# Altium schematic sheet Generator_REO.SchDoc
size 420 x 297 mm; SheetNumber: 2; SheetTotal: 6
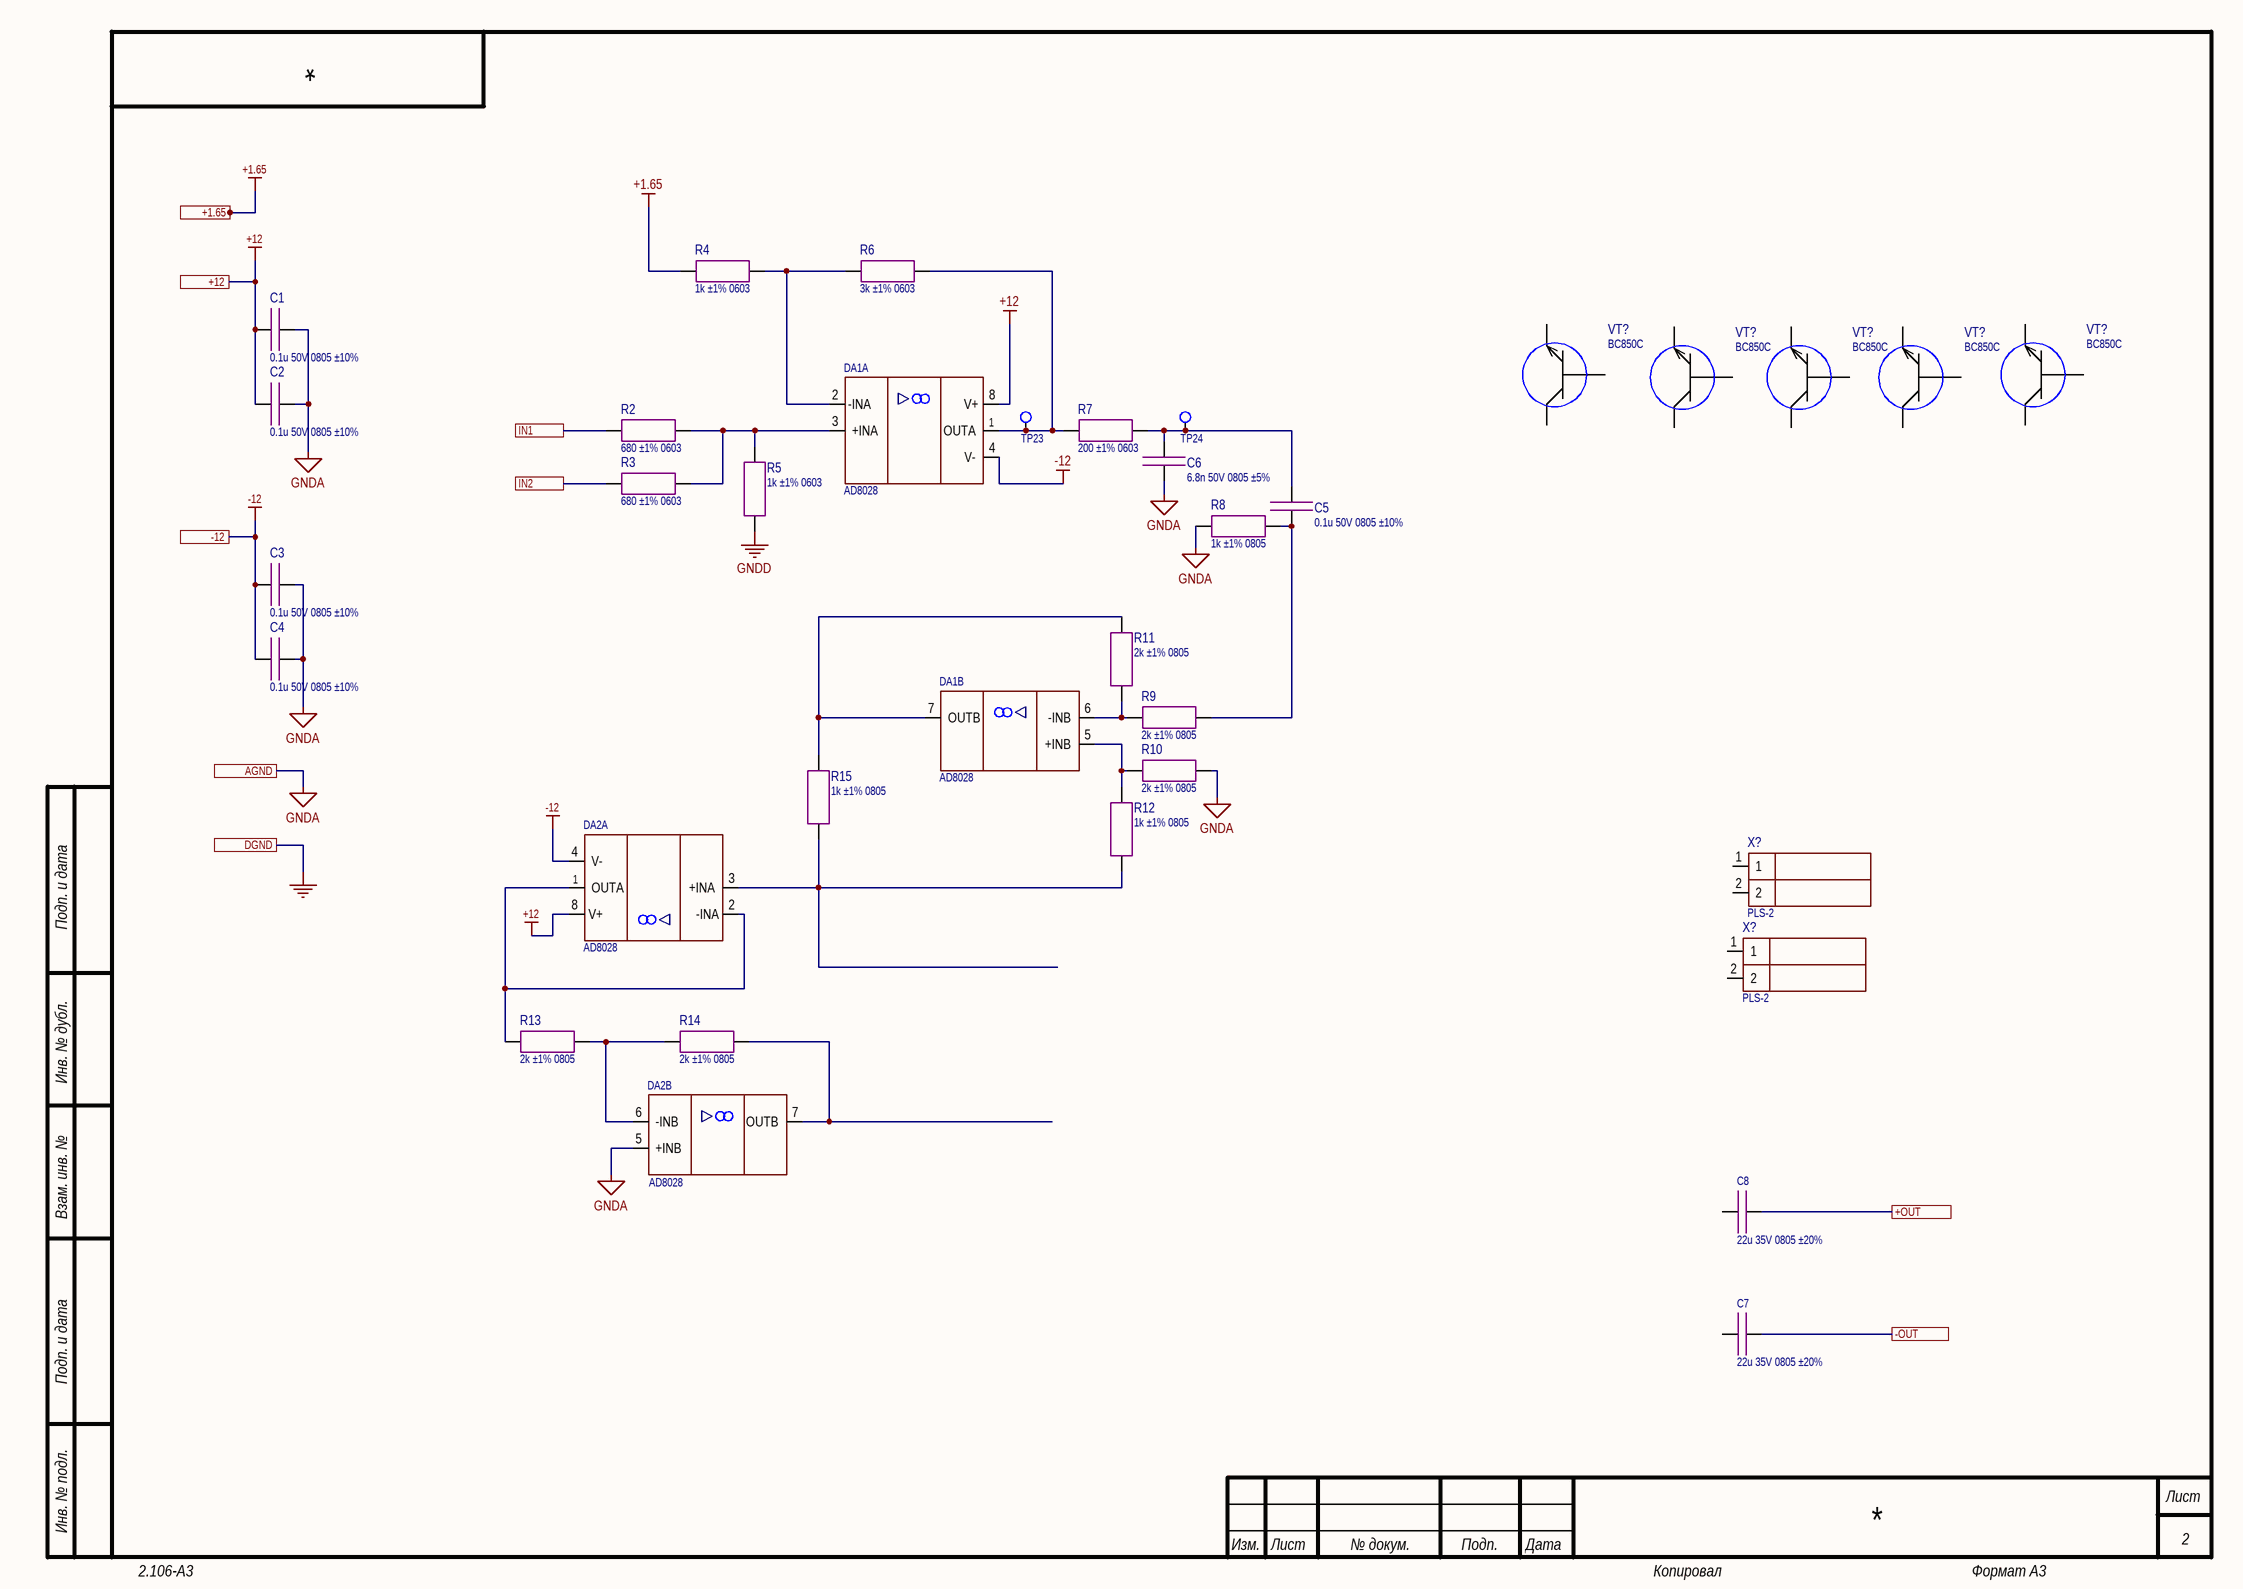
[diagram p0: Generator_REO.SchDoc]

## Parts
(Parts that share a designator on the sheet are numbered #1, #2 ... from top to bottom, then left to right.)
C1  0.1u 50V 0805 ±10%  [CAP: SMD 0805 MD IPC 782]
C2  0.1u 50V 0805 ±10%  [CAP: SMD 0805 MD IPC 782]
C3  0.1u 50V 0805 ±10%  [CAP: SMD 0805 MD IPC 782]
C4  0.1u 50V 0805 ±10%  [CAP: SMD 0805 MD IPC 782]
C5  0.1u 50V 0805 ±10%  [CAP: SMD 0805 MD IPC 782]
C6  6.8n 50V 0805 ±5%  [CAP: SMD 0805 MD IPC 782]
C7  22u 35V 0805 ±20%  [CAP: SMD 0805 MD IPC 782]
C8  22u 35V 0805 ±20%  [CAP: SMD 0805 MD IPC 782]
DA1  AD8028  [IC: SOIC 8]  (parts A,B of 2)
DA2  AD8028  [IC: SOIC 8]  (parts A,B of 2)
R2  680 ±1% 0603  [RES: SMD 0603 MD IPC 782]
R3  680 ±1% 0603  [RES: SMD 0603 MD IPC 782]
R4  1k ±1% 0603  [RES: SMD 0603 MD IPC 782]
R5  1k ±1% 0603  [RES: SMD 0603 MD IPC 782]
R6  3k ±1% 0603  [RES: SMD 0603 MD IPC 782]
R7  200 ±1% 0603  [RES: SMD 0603 MD IPC 782]
R8  1k ±1% 0805  [RES: SMD 0805 MD IPC 782]
R9  2k ±1% 0805  [RES: SMD 0805 MD IPC 782]
R10  2k ±1% 0805  [RES: SMD 0805 MD IPC 782]
R11  2k ±1% 0805  [RES: SMD 0805 MD IPC 782]
R12  1k ±1% 0805  [RES: SMD 0805 MD IPC 782]
R13  2k ±1% 0805  [RES: SMD 0805 MD IPC 782]
R14  2k ±1% 0805  [RES: SMD 0805 MD IPC 782]
R15  1k ±1% 0805  [RES: SMD 0805 MD IPC 782]
TP23  Test point  [Test Point]  (value not drawn)  (net tie)
TP24  Test point  [Test Point]  (value not drawn)  (net tie)
VT?#1  BC850C  [IC: SOT 23]
VT?#2  BC850C  [IC: SOT 23]
VT?#3  BC850C  [IC: SOT 23]
VT?#4  BC850C  [IC: SOT 23]
VT?#5  BC850C  [IC: SOT 23]
X?#1  PLS-2  [CON: 2PIN PLS 2]
X?#2  PLS-2  [CON: 2PIN PLS 2]

## Ports
+1.65 (see REO_ECG[2C], ECG[4A], POWER[1A]), +12 (see REO_ECG[2B], ECG[4A], INTERFACES[4A], Measurement_REO[4A], POWER[1B]), +OUT (see REO_ECG[3B]), -12 (see REO_ECG[2B], ECG[4A], INTERFACES[4A], Measurement_REO[4A], POWER[1B]), -OUT (see REO_ECG[3B]), AGND (see REO_ECG[3B], ECG[4B], Measurement_REO[4A], POWER[1B]), DGND (see REO_ECG[3B], POWER[1B]), IN1 (see REO_ECG[2B]), IN2 (see REO_ECG[2B])

## Nets
+1.65: R4.1 ; port +1.65
+12: C1.2 C2.2 DA1.8(V+) DA2.8(V+) ; port +12
-12: C3.2 C4.2 DA1.4(V-) DA2.4(V-) ; port -12
GND: port DGND
GNDA: C1.1 C2.1 C3.1 C4.1 C6.2 DA2.5(+INB) R8.1 R10.2 ; port AGND
GNDD: R5.1
+OUT: C8.1 ; port +OUT
-OUT: C7.1 ; port -OUT
IN1: R2.1 ; port IN1
IN2: R3.1 ; port IN2
NetC5_1: C5.1 R8.2 R9.2
NetC5_2: C5.2 C6.1 R7.2 TP24.1
NetDA1_1: DA1.1(OUTA) R6.2 R7.1 TP23.1
NetDA1_2: DA1.2(-INA) R4.2 R6.1
NetDA1_3: DA1.3(+INA) R2.2 R3.2 R5.2
NetDA1_5: DA1.5(+INB) R10.1 R12.2
NetDA1_6: DA1.6(-INB) R9.1 R11.2
NetDA1_7: DA1.7(OUTB) R11.1 R15.1
NetDA2_1: DA2.1(OUTA) DA2.2(-INA) R13.1
NetDA2_3: DA2.3(+INA) R12.1 R15.2
NetDA2_6: DA2.6(-INB) R13.2 R14.1
NetDA2_7: DA2.7(OUTB) R14.2

Not connected (* = marked no-connect by the designer): C7 2; C8 2; VT?#1 1 2 3; VT?#2 1 2 3; VT?#3 1 2 3; VT?#4 1 2 3; VT?#5 1 2 3; X?#1 1 2; X?#2 1 2

## Notes on the sheet
- Подп. и дата
- Инв. № дубл.
- Взам. инв. №
- Инв. № подл.
- Изм.
- Лист
- № докум.
- Подп.
- Дата
- 2.106-A3
- Копировал
- Формат А3

## Library data of the parts
C1-C5 = 0.1u 50V 0805 ±10%: Code: 6279254871; Name: Конденсатор X7R 50V 0,1uF ±10% 0805
C6 = 6.8n 50V 0805 ±5%: Code: 6279352311; Name: Конденсатор NPO 50V 6800pF ±5% 0805
C7 C8 = 22u 35V 0805 ±20%: Code: 6279375691; Name: Конденсатор X5R 35V 22uF±20% 0805
DA1 DA2 = AD8028_part
R2 R3 = 680 ±1% 0603: Code: 6069180761; Name: Резистор 680R ±1% 0603
R4 R5 = 1k ±1% 0603: Code: 6069174188; Name: Резистор 1k ±1% 0603
R6 = 3k ±1% 0603: Code: 6094357331; Name: Резистор 3К ±1% 0603
R7 = 200 ±1% 0603: Code: 6069180621; Name: Резистор 200R±1% 0603
R8 R12 R15 = 1k ±1% 0805: Code: 6027158691; Name: Резистор RC0805FR-071KL, Yageo
R9-R11 R13 R14 = 2k ±1% 0805: Code: 6094352561; Name: Резистор 2k±1%  0805
VT?#1-VT?#5 = BJT NPN BC850C: Code: 6340001151; Name: Транзистор BC850C,215, Nexperia
X?#1 X?#2 = 2 pin PLS 2: Code: 6313952321; Name: Вилка PLS-2